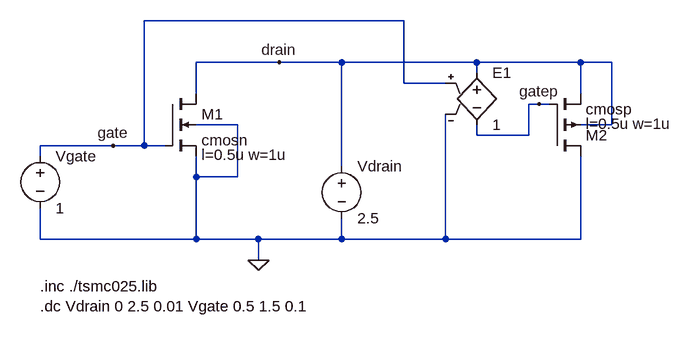
[diagram p0: schematic test_tsmc025.asc]
test_tsmc025.asc, the LTspice schematic file:
Version 4
SHEET 1 1124 680
WIRE 704 112 304 112
WIRE 512 176 384 176
WIRE 608 176 512 176
WIRE 816 176 608 176
WIRE 976 176 816 176
WIRE 1024 176 976 176
WIRE 816 192 816 176
WIRE 704 208 704 112
WIRE 768 208 704 208
WIRE 384 224 384 176
WIRE 976 224 976 176
WIRE 912 240 896 240
WIRE 928 240 912 240
WIRE 448 272 384 272
WIRE 1024 272 1024 176
WIRE 1024 272 976 272
WIRE 816 288 816 272
WIRE 896 288 896 240
WIRE 896 288 816 288
WIRE 256 304 144 304
WIRE 304 304 304 112
WIRE 304 304 256 304
WIRE 336 304 304 304
WIRE 144 320 144 304
WIRE 608 336 608 176
WIRE 384 352 384 320
WIRE 448 352 448 272
WIRE 448 352 384 352
WIRE 144 448 144 400
WIRE 384 448 384 352
WIRE 384 448 144 448
WIRE 480 448 384 448
WIRE 608 448 608 416
WIRE 608 448 480 448
WIRE 768 448 768 256
WIRE 768 448 608 448
WIRE 976 448 976 320
WIRE 976 448 768 448
WIRE 480 480 480 448
FLAG 512 176 drain
FLAG 256 304 gate
FLAG 480 480 0
FLAG 912 240 gatep
SYMBOL nmos4 336 224 R0
WINDOW 123 56 94 Left 2
SYMATTR InstName M1
SYMATTR Value cmosn
SYMATTR Value2 l=0.5u w=1u
SYMBOL voltage 144 304 R0
SYMATTR InstName Vgate
SYMATTR Value 1
SYMBOL voltage 608 320 R0
SYMATTR InstName Vdrain
SYMATTR Value 2.5
SYMBOL pmos4 928 320 M180
WINDOW 123 56 50 Left 2
SYMATTR InstName M2
SYMATTR Value cmosp
SYMATTR Value2 l=0.5u w=1u
SYMBOL e 816 176 R0
SYMATTR InstName E1
SYMATTR Value 1
TEXT 144 520 Left 2 !.inc ./tsmc025.lib\n.dc Vdrain 0 2.5 0.01 Vgate 0.5 1.5 0.1

The netlist it stands for:
* test_tsmc025.asc
M1 drain gate 0 0 cmosn l=0.5u w=1u
Vgate gate 0 1
Vdrain drain 0 2.5
M2 0 gatep drain drain cmosp l=0.5u w=1u
E1 drain gatep gate 0 1
.model NMOS NMOS
.model PMOS PMOS
.lib standard.mos
.inc ./tsmc025.lib
.dc Vdrain 0 2.5 0.01 Vgate 0.5 1.5 0.1
.backanno
.end